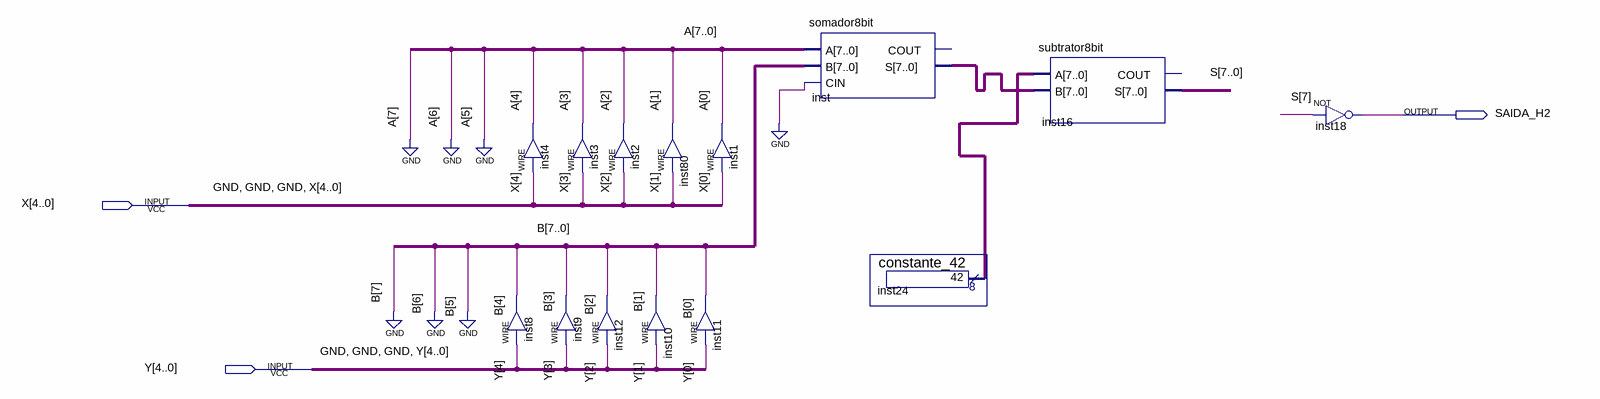
[diagram p0: schematic sheet]
// Quartus schematic neuronio__h2.bdf as structural Verilog: 14 symbols, 3 pins
module neuronio__h2 (
  input  [4:0] X,
  input  [4:0] Y,
  output SAIDA_H2
);

  wire [4:0] A, B;
  wire [7:0] inst24_result, inst_s, S;

  assign B[4] = Y[4];  // WIRE inst8
  assign A[4] = X[4];  // WIRE inst4
  assign A[3] = X[3];  // WIRE inst3
  assign B[3] = Y[3];  // WIRE inst9
  assign A[2] = X[2];  // WIRE inst2
  assign B[2] = Y[2];  // WIRE inst12
  assign A[1] = X[1];  // WIRE inst80
  assign B[1] = Y[1];  // WIRE inst10
  assign B[0] = Y[0];  // WIRE inst11
  assign A[0] = X[0];  // WIRE inst1
  somador8bit inst (.A({3'b000, A}), .B({3'b000, B}), .CIN(1'b0), .S(inst_s));  // open: COUT
  constante_42 inst24 (.result(inst24_result));
  subtrator8bit inst16 (.A(inst24_result), .B(inst_s), .S(S));  // open: COUT
  not inst18 (SAIDA_H2, S[7]);
endmodule
